# EAGLE design sonic-telemeter (EAGLE 9.6.2)
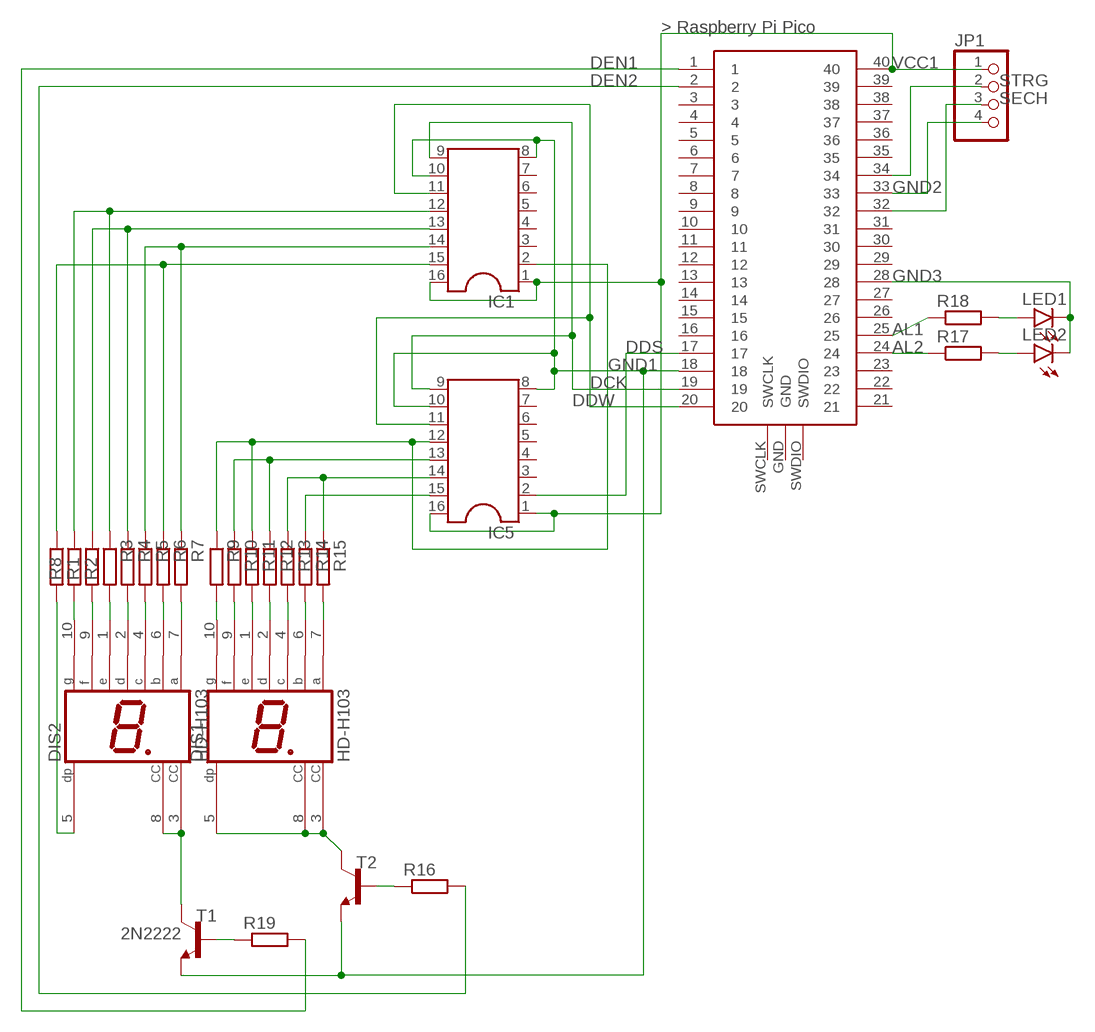
[diagram p0: schematic, sheet 1]

## Parts
DIS1  HD-H103  [HDSP-M]
DIS2  HD-H103  [HDSP-M]
IC1  DIL16  [DIL16]
IC5  DIL16  [DIL16]
JP1  PINHD-1X4  [1X04]
LED1  LED5MM  [LED5MM]
LED2  LED5MM  [LED5MM]
R1  R-EU_0204/5  [0204/5]
R2  R-EU_0204/5  [0204/5]
R3  R-EU_0204/5  [0204/5]
R4  R-EU_0204/5  [0204/5]
R5  R-EU_0204/5  [0204/5]
R6  R-EU_0204/5  [0204/5]
R7  R-EU_0204/5  [0204/5]
R8  R-EU_0204/5  [0204/5]
R9  R-EU_0204/5  [0204/5]
R10  R-EU_0204/5  [0204/5]
R11  R-EU_0204/5  [0204/5]
R12  R-EU_0204/5  [0204/5]
R13  R-EU_0204/5  [0204/5]
R14  R-EU_0204/5  [0204/5]
R15  R-EU_0204/5  [0204/5]
R16  R-EU_0204/5  [0204/5]
R17  R-EU_0204/5  [0204/5]
R18  R-EU_0204/5  [0204/5]
R19  R-EU_0204/5  [0204/5]
T1  2N2222  [TO18]
T2  2N2222  [TO18]
U$1  RASPBERRY-PI-PICO_TH  [FT_RASPBERRY-PI-PICO_TH]

## Nets
AL1: R18.1 U$1.25
AL2: R17.1 U$1.24
DCK: IC1.9 IC5.9 U$1.19
DDS: IC5.2 U$1.17
DDW: IC1.11 IC5.11 U$1.20
DEN1: R19.2 U$1.1
DEN2: R16.2 U$1.2
GND1: IC1.8 IC1.10 IC5.8 IC5.10 T1.1(E) T2.1(E) U$1.18
GND2: JP1.4 U$1.33
GND3: LED1.K(C) LED2.K(C) U$1.28
N$1: IC1.15 R6.1 R8.1
N$2: IC1.14 R5.1 R7.1
N$3: IC1.13 R2.1 R4.1
N$4: IC1.12 R1.1 R3.1
N$5: IC5.13 R10.1 R12.1
N$6: IC5.15 R14.1
N$7: DIS2.3(CC) DIS2.8(CC) T1.3(C)
N$8: DIS1.3(CC) DIS1.5(DP) DIS1.8(CC) T2.3(C)
N$12: DIS2.10(G) R1.2
N$13: DIS2.9(F) R2.2
N$14: DIS2.1(E) R3.2
N$15: DIS2.2(D) R4.2
N$16: DIS2.4(C) R5.2
N$17: DIS2.6(B) R6.2
N$18: DIS2.7(A) R7.2
N$20: R16.1 T2.2(B)
N$23: DIS2.5(DP) R8.2
N$28: R19.1 T1.2(B)
N$29: DIS1.10(G) R9.2
N$30: DIS1.9(F) R10.2
N$31: DIS1.1(E) R11.2
N$32: DIS1.2(D) R12.2
N$33: DIS1.4(C) R13.2
N$34: DIS1.6(B) R14.2
N$35: DIS1.7(A) R15.2
N$42: LED2.A R17.2
N$43: LED1.A R18.2
N$45: IC1.2 IC5.12 R9.1 R11.1
N$46: IC5.14 R13.1 R15.1
SECH: JP1.3 U$1.32
STRG: JP1.2 U$1.34
VCC1: IC1.1 IC1.16 IC5.1 IC5.16 JP1.1 U$1.40
Unconnected: IC1.3 IC1.4 IC1.5 IC1.6 IC1.7 IC5.3 IC5.4 IC5.5 IC5.6 IC5.7 U$1.3 U$1.4 U$1.5 U$1.6 U$1.7 U$1.8 U$1.9 U$1.10 U$1.11 U$1.12 U$1.13 U$1.14 U$1.15 U$1.16 U$1.21 U$1.22 U$1.23 U$1.26 U$1.27 U$1.29 U$1.30 U$1.31 U$1.35 U$1.36 U$1.37 U$1.38 U$1.39 U$1.GND U$1.SWCLK U$1.SWDIO

## Library data of the parts
DIS1 DIS2 = display-hp:HD-H103: LED DISPLAY 1-character 7 segment, decimal point right; OC_FARNELL: unknown; OC_NEWARK: unknown
IC1 IC5 = ic-package:DIL16: Dual In Line / Socket
JP1 = pinhead:PINHD-1X4: PIN HEADER
LED1 LED2 = led:LED: LED OSRAM: - CHIPLED LG R971, LG N971, LY N971, LG Q971, LY Q971, LO R971, LY R971 LH N974, LH R974 LS Q976, LO Q976, LY Q976 LO Q996 - Hyper CHIPLED LW Q18S LB Q993, LB Q99A, LB R99A - SideLED LS A670, LO A670, LY A670, LG A670, LP A670 LB A673, LV A673, LT A673, LW A673 LH A674 LY A675 LS A676, LA A676, LO A676, LY A676, LW A676 LS A679, LY A679, LG A679 - Hyper Micro SIDELED® LS Y876, LA Y876, LO Y876, LY Y876 LT Y87S - SmartLED LW L88C, LW L88S LB L89C, LB L89S, LG L890 LS L89K, LO L89K, LY L89K LS L896, LA L896, LO L896, LY L896 - TOPLED LS T670, LO T670, LY T670, LG T670, LP T670 LSG T670, LSP T670, LSY T670, LOP T670, LYG T670 LG T671, LOG T671, LSG T671 LB T673, LV T673, LT T673, LW T673 LH T674 LS T676, LA T676, LO T676, LY T676, LB T676, LH T676, LSB T676, LW T676 LB T67C, LV T67C, LT T67C, LS T67K, LO T67K, LY T67K, LW E67C LS E67B, LA E67B, LO E67B, LY E67B, LB E67C, LV E67C, LT E67C LW T67C LS T679, LY T679, LG T679 LS T770, LO T770, LY T770, LG T770, LP T770 LB T773, LV T773, LT T773, LW T773 LH T774 LS E675, LA E675, LY E675, LS T675 LS T776, LA T776, LO T776, LY T776, LB T776 LHGB T686 LT T68C, LB T68C - Hyper Mini TOPLED® LB M676 - Mini TOPLED Santana® LG M470 LS M47K, LO M47K, LY M47K Source: http://www.osram.convergy.de LUXEON: - LUMILED® LXK2-PW12-R00, LXK2-PW12-S00, LXK2-PW14-U00, LXK2-PW14-V00 LXK2-PM12-R00, LXK2-PM12-S00, LXK2-PM14-U00 LXK2-PE12-Q00, LXK2-PE12-R00, LXK2-PE12-S00, LXK2-PE14-T00, LXK2-PE14-U00 LXK2-PB12-K00, LXK2-PB12-L00, LXK2-PB12-M00, LXK2-PB14-N00, LXK2-PB14-P00, LXK2-PB14-Q00 LXK2-PR12-L00, LXK2-PR12-M00, LXK2-PR14-Q00, LXK2-PR14-R00 LXK2-PD12-Q00, LXK2-PD12-R00, LXK2-PD12-S00 LXK2-PH12-R00, LXK2-PH12-S00 LXK2-PL12-P00, LXK2-PL12-Q00, LXK2-PL12-R00 Source: www.luxeon.com KINGBRIGHT: KA-3528ASYC Source: www.kingbright.com
R1-R19 = rcl:R-EU_: RESISTOR, European symbol; SPICEPREFIX: R
T1 T2 = transistor:2N2222: NPN TRANSISTOR
U$1 = pipico:RASPBERRY-PI-PICO_TH: Raspberry Pi Pico microcontroller board for through-hole mounting.

## Board
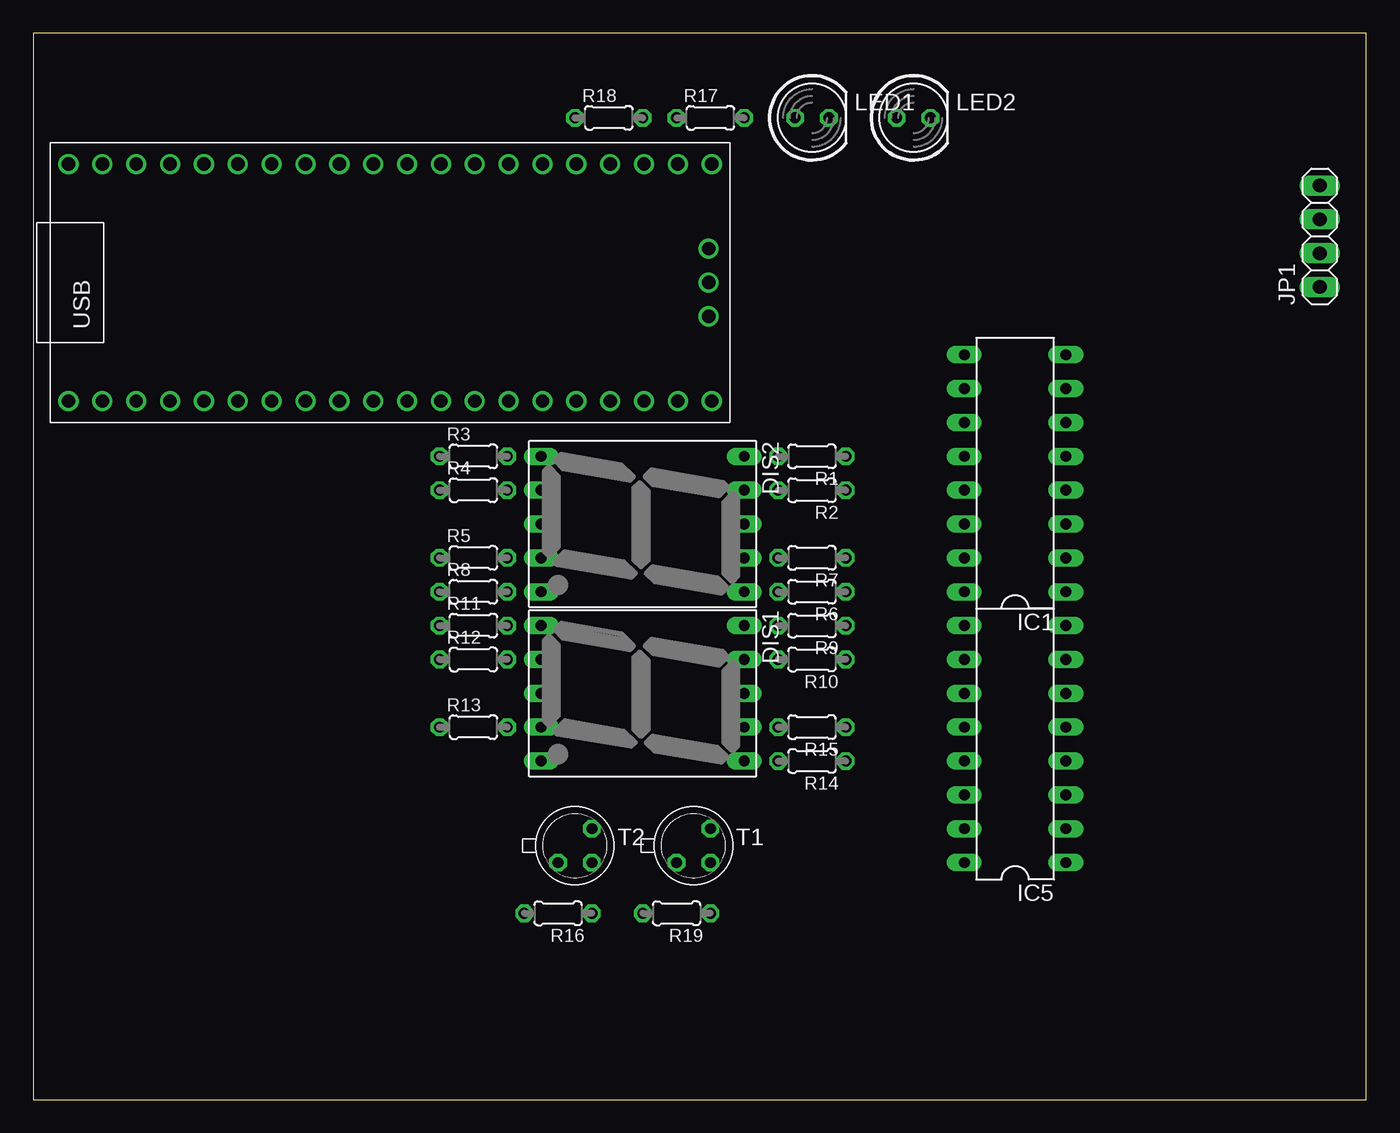
[diagram p1: board, top side]
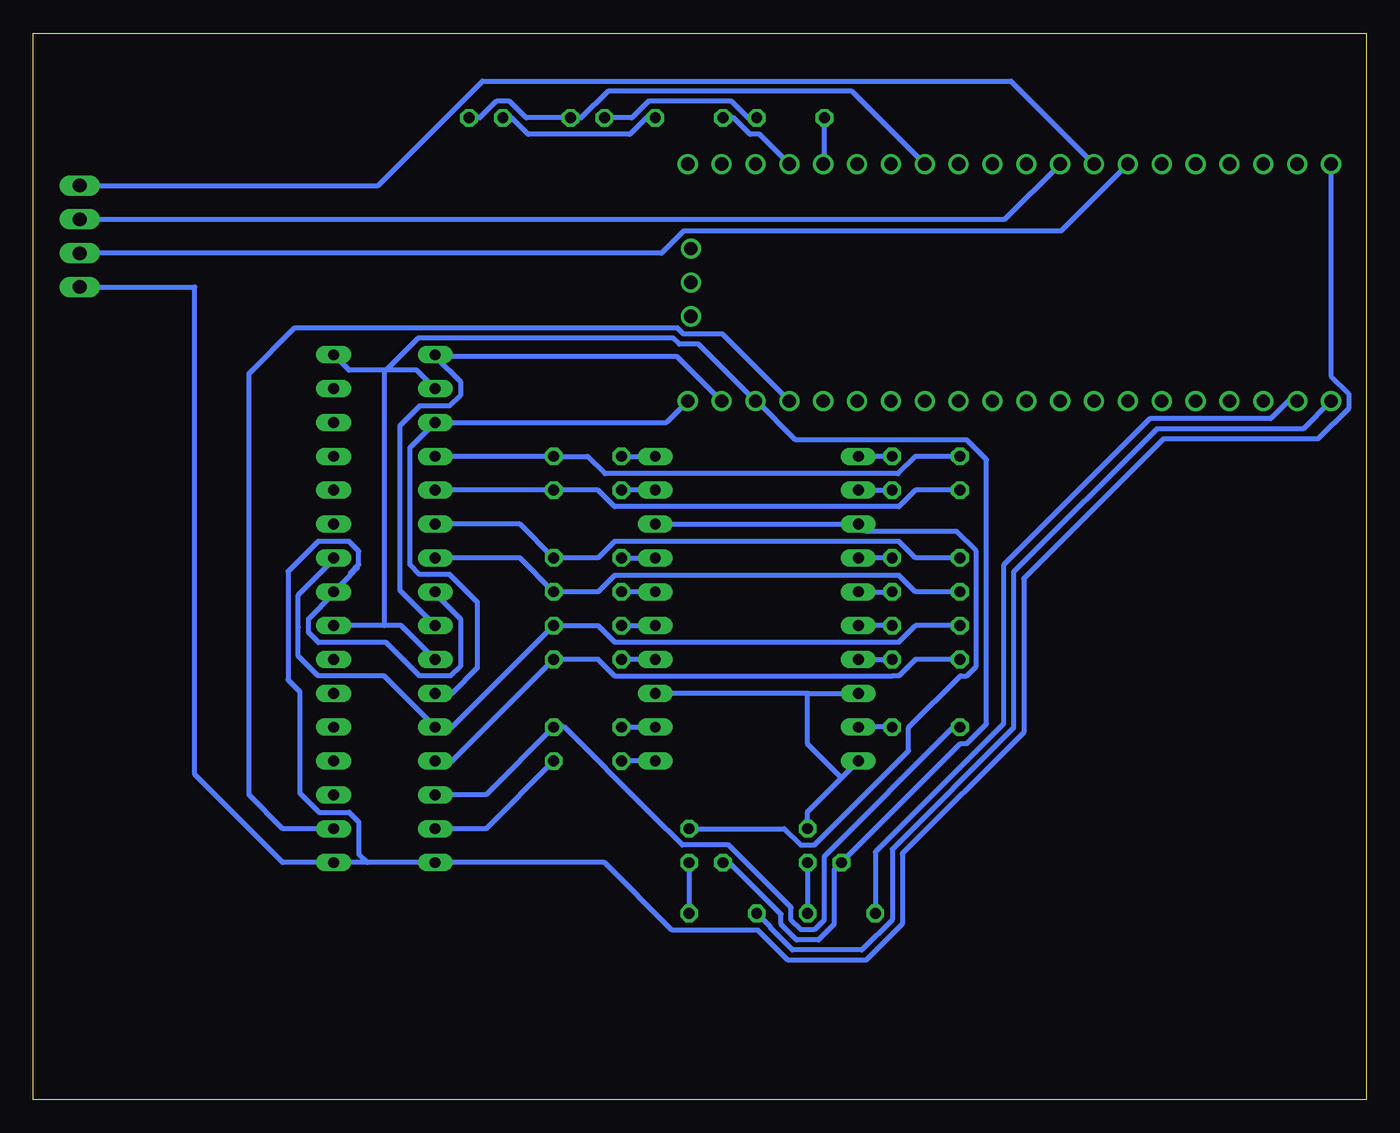
[diagram p2: board, bottom side, seen from below]

Size 100 x 80 mm. Coordinates in mm from the lower left corner, seen from the top.
Outline: 0,0 100,0 100,80 0,80 0,0
Copper layers (1*16): Top 0.035mm / dielectric 1.5mm / Bottom 0.035mm
Design rules "default *": minimum track width 15mil, minimum drill 0.35mm, track to track 15mil, track to pad 15mil, pad to pad 15mil, via to via 15mil, smd to smd 6mil, copper to edge 40mil, drill to drill 6mil, minimum pad ring 10mil, minimum via ring 8mil, stop-mask expansion 4mil, vias tented up to drill 0mil, thermal gap 10mil

### Footprints (pad centres in the part's own frame; a part is rotated, then mirrored left to right if it is on the bottom)
HDSP-M = drill 0.813 long: 1 -5.08,-7.62; 2 -2.54,-7.62; 3 0,-7.62; 4 2.54,-7.62; 5 5.08,-7.62; 6 5.08,7.62; 7 2.54,7.62; 8 0,7.62; 9 -2.54,7.62; 10 -5.08,7.62
DIL16 = drill 0.813 long: 1 -8.89,-3.81; 2 -6.35,-3.81; 3 -3.81,-3.81; 4 -1.27,-3.81; 5 1.27,-3.81; 6 3.81,-3.81; 7 6.35,-3.81; 8 8.89,-3.81; 9 8.89,3.81; 10 6.35,3.81; 11 3.81,3.81; 12 1.27,3.81; 13 -1.27,3.81; 14 -3.81,3.81; 15 -6.35,3.81; 16 -8.89,3.81
1X04 = drill 1.016 long: 1 -3.81,0; 2 -1.27,0; 3 1.27,0; 4 3.81,0
LED5MM = drill 0.813 octagon: A -1.27,0; K 1.27,0
0204/5 = drill 0.813 octagon: 1 -2.54,0; 2 2.54,0
TO18 = drill 0.813 octagon: 1 -1.27,-1.27; 2 1.27,-1.27; 3 1.27,1.27
FT_RASPBERRY-PI-PICO_TH = drill 1: 1 -8.55,24.03; 2 -8.55,21.49; 3 -8.55,18.95; 4 -8.55,16.41; 5 -8.55,13.87; 6 -8.55,11.33; 7 -8.55,8.79; 8 -8.55,6.25; 9 -8.55,3.71; 10 -8.55,1.17; 11 -8.55,-1.37; 12 -8.55,-3.91; 13 -8.55,-6.45; 14 -8.55,-8.99; 15 -8.55,-11.53; 16 -8.55,-14.07; 17 -8.55,-16.61; 18 -8.55,-19.15; 19 -8.55,-21.69; 20 -8.55,-24.23; 21 9.23,-24.23; 22 9.23,-21.69; 23 9.23,-19.15; 24 9.23,-16.61; 25 9.23,-14.07; 26 9.23,-11.53; 27 9.23,-8.99; 28 9.23,-6.45; 29 9.23,-3.91; 30 9.23,-1.37; 31 9.23,1.17; 32 9.23,3.71; 33 9.23,6.25; 34 9.23,8.79; 35 9.23,11.33; 36 9.23,13.87; 37 9.23,16.41; 38 9.23,18.95; 39 9.23,21.49; 40 9.23,24.03; GND 0.34,-24; SWCLK -2.2,-24; SWDIO 2.88,-24

### Placement (x,y rotation side)
DIS1  45.72,30.48 270 top
DIS2  45.72,43.18 270 top
IC1  73.66,46.99 90 top
IC5  73.66,26.67 90 top
JP1  96.52,64.77 90 top
LED1  58.42,73.66 0 top
LED2  66.04,73.66 0 top
R1  58.42,48.26 180 top
R2  58.42,45.72 180 top
R3  33.02,48.26 0 top
R4  33.02,45.72 0 top
R5  33.02,40.64 0 top
R6  58.42,38.1 180 top
R7  58.42,40.64 180 top
R8  33.02,38.1 0 top
R9  58.42,35.56 180 top
R10  58.42,33.02 180 top
R11  33.02,35.56 0 top
R12  33.02,33.02 0 top
R13  33.02,27.94 0 top
R14  58.42,25.4 180 top
R15  58.42,27.94 180 top
R16  39.37,13.97 180 top
R17  50.8,73.66 0 top
R18  43.18,73.66 0 top
R19  48.26,13.97 180 top
T1  49.53,19.05 0 top
T2  40.64,19.05 0 top
U$1  26.67,60.96 90 top

### Tracks (layer width: path | path; a pad name or v marks a point on that pad's centre or on a via)
AL1
  Bottom 0.381: U$1.25 40.64,70.29 R18.1
AL2
  Bottom 0.381: U$1.24 45.52,72.43 46.23,72.43 47.46,73.66 R17.1
DCK
  Bottom 0.381: U$1.19 51.69,55.74 69.85,55.74 | IC1.9 69.85,55.74 | 69.85,55.74 67.96,53.85 67.96,52.83 68.76,52.03 71.02,52.03 72.5,50.55 72.5,38.21 IC5.9
DDS
  Bottom 0.381: U$1.17 48.3,57.43 51.22,57.43 51.7,57.91 80.38,57.91 83.82,54.47 83.82,22.86 81.28,20.32 IC5.2
DDW
  Bottom 0.381: U$1.20 52.51,50.8 IC1.11 71.74,48.91 71.74,40.13 71.02,39.41 68.76,39.41 66.69,37.34 66.69,32.37 68.58,30.48 IC5.11
DEN1
  Bottom 0.381: U$1.1 4.73,50.32 15.72,50.32 26.45,39.59 26.45,27.88 35.56,18.77 35.56,13.5 37.84,11.21 43.05,11.21 44.67,12.83 44.67,12.92 R19.2
DEN2
  Bottom 0.381: U$1.2 5.84,52.41 7.17,51.08 16.23,51.08 27.22,40.09 27.22,28.19 36.83,18.58 R16.2
GND1
  Bottom 0.381: IC1.10 71.23,54.72 73.55,54.72 | 73.55,54.72 76.31,54.72 IC1.8 | 73.55,54.72 71.12,57.15 52.01,57.15 51.53,56.67 50.08,56.67 U$1.18 45.72,52.41 42.8,49.49 29.97,49.49 28.49,48.01 28.49,28.19 29.97,26.71 30.44,26.71 T2.1 39.92,17.23 39.92,13.14 41.08,11.98 42.74,11.98 43.9,13.14 43.9,13.9 47.79,17.78 T1.1 | IC5.10 72.39,35.56 73.66,35.56 | 73.66,35.56 IC5.8 | 73.66,35.56 73.66,54.61 73.55,54.72
GND2
  Bottom 0.381: JP1.4 74.13,68.58 66.3,76.42 26.65,76.42 U$1.33
GND3
  Bottom 0.381: LED2.K 66.51,73.66 65.28,74.89 64.26,74.89 63.03,73.66 LED1.K 58.89,73.66 56.9,75.65 38.58,75.65 U$1.28
N$1
  Bottom 0.381: IC1.15 63.5,40.64 R6.1 57.62,38.1 56.39,39.33 35.05,39.33 33.82,38.1 R8.1
N$2
  Bottom 0.381: IC1.14 63.5,43.18 R7.1 57.62,40.64 56.39,41.87 35.05,41.87 33.82,40.64 R5.1
N$3
  Bottom 0.381: IC1.13 R2.1 57.62,45.72 56.39,44.49 35.05,44.49 33.82,45.72 R4.1
N$4
  Bottom 0.381: IC1.12 R1.1 58.42,48.26 57.11,46.95 35.13,46.95 33.82,48.26 R3.1
N$5
  Bottom 0.381: IC5.13 68.58,25.4 R10.1 57.62,33.02 56.35,31.75 35.56,31.75 35.52,31.79 35.05,31.79 33.82,33.02 R12.1
N$6
  Bottom 0.381: R14.1 66.04,20.32 IC5.15
N$7
  Bottom 0.381: DIS2.8 DIS2.3 37.55,42.63 30.73,42.63 29.25,41.15 29.25,32.51 29.97,31.79 30.44,31.79 34.33,27.9 34.33,26.16 41.4,19.09 42.42,19.09 43.65,20.32 T1.3
N$8
  Bottom 0.381: T2.3 41.91,21.59 39.37,24.13 | 39.37,24.13 DIS1.5 | 39.37,24.13 41.91,26.67 41.91,30.48 | 41.91,30.48 DIS1.3 | 41.91,30.48 DIS1.8
N$12
  Bottom 0.381: R1.2 DIS2.10
N$13
  Bottom 0.381: DIS2.9 R2.2
N$14
  Bottom 0.381: R3.2 DIS2.1
N$15
  Bottom 0.381: DIS2.2 R4.2
N$16
  Bottom 0.381: R5.2 DIS2.4
N$17
  Bottom 0.381: DIS2.6 R6.2
N$18
  Bottom 0.381: R7.2 DIS2.7
N$20
  Bottom 0.381: T2.2 R16.1
N$23
  Bottom 0.381: DIS2.5 R8.2
N$28
  Bottom 0.381: T1.2 R19.1
N$29
  Bottom 0.381: R9.2 DIS1.10
N$30
  Bottom 0.381: DIS1.9 R10.2
N$31
  Bottom 0.381: R11.2 DIS1.1
N$32
  Bottom 0.381: DIS1.2 R12.2
N$33
  Bottom 0.381: R13.2 DIS1.4
N$34
  Bottom 0.381: DIS1.6 R14.2
N$35
  Bottom 0.381: R15.2 DIS1.7
N$42
  Bottom 0.381: R17.2 54.01,73.66 55.24,72.43 62.87,72.43 64.11,73.66 LED2.A
N$43
  Bottom 0.381: 57.15,74.13 LED1.A 55.08,73.66 53.85,74.89 47.62,74.89 46.38,73.66 R18.2
N$45
  Bottom 0.381: R11.1 33.82,35.56 35.05,34.33 56.39,34.33 57.62,35.56 R9.1 68.58,27.94 IC5.12 73.7,31.79 78.64,31.79 80.12,33.27 80.12,35.45 80.12,37.85 77.47,40.5 IC1.2
N$46
  Bottom 0.381: IC5.14 66.04,22.86 R15.1 60.16,27.94 53.81,21.59 53.58,21.35 51.31,19.09 47.83,19.09 43.14,14.4 43.14,13.46 42.42,12.74 41.4,12.74 40.68,13.46 40.68,18.21 30.95,27.94 R13.1
SECH
  Bottom 0.381: JP1.3 27.11,66.04 U$1.32
STRG
  Bottom 0.381: JP1.2 52.88,63.5 51.22,65.17 22.9,65.17 U$1.34
VCC1
  Bottom 0.381: U$1.40 2.64,54.28 1.31,52.96 1.31,51.86 3.62,49.56 15.21,49.56 25.69,39.08 25.69,27.56 34.8,18.45 34.8,13.18 37.53,10.45 43.37,10.45 45.62,12.7 52.07,12.7 57.15,17.78 IC5.16 74.93,17.78 | JP1.1 87.88,60.96 87.88,24.38 81.28,17.78 IC5.1 74.93,17.78 | IC1.16 69.85,37.96 67.96,36.07 67.96,32.51 68.68,31.79 71.02,31.79 73.52,34.29 78.6,34.29 79.36,35.05 79.36,36.07 77.47,37.96 IC1.1 76.2,39.37 | 76.2,39.37 75.69,39.88 | 76.2,39.37 76.2,39.51 75.58,40.13 75.58,41.15 76.3,41.87 78.64,41.87 80.89,39.63 80.89,31.49 80.01,30.62 80.01,23 78.56,21.55 76.3,21.55 75.58,20.83 75.58,18.43 74.93,17.78